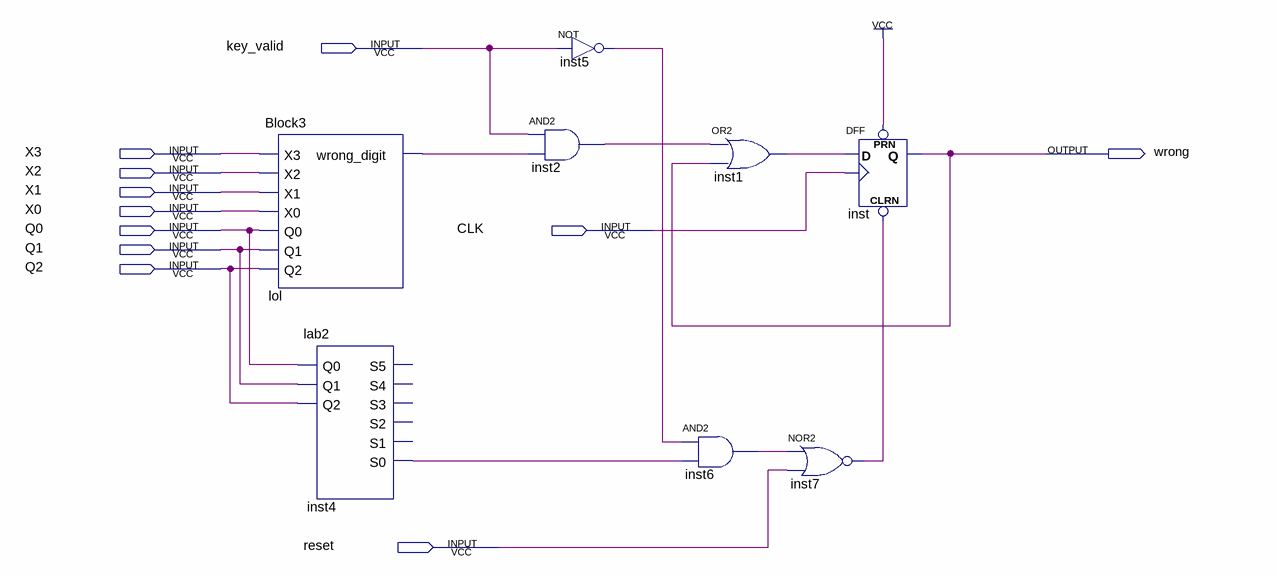
[diagram p0: schematic sheet]
// Quartus schematic Block4.bdf as structural Verilog: 8 symbols, 11 pins
module Block4 (
  input  key_valid,
  input  X3,
  input  X2,
  input  X1,
  input  X0,
  input  Q0,
  input  CLK,
  input  Q1,
  input  Q2,
  input  reset,
  output wrong
);

  wire inst1_out, inst2_out, inst4_s0, inst5_out, inst6_out, inst7_out, lol_wrong_digit;

  Block3 lol (.X3(X3), .X2(X2), .X1(X1), .X0(X0), .Q0(Q0), .Q1(Q1), .Q2(Q2), .wrong_digit(lol_wrong_digit));
  lab2 inst4 (.Q0(Q0), .Q1(Q1), .Q2(Q2), .S0(inst4_s0));  // open: S5, S4, S3, S2, S1
  and inst2 (inst2_out, key_valid, lol_wrong_digit);
  not inst5 (inst5_out, key_valid);
  and inst6 (inst6_out, inst5_out, inst4_s0);
  or inst1 (inst1_out, inst2_out, wrong);
  DFF inst (.CLRN(inst7_out), .CLK(CLK), .D(inst1_out), .PRN(1'b1), .Q(wrong));
  nor inst7 (inst7_out, inst6_out, reset);
endmodule
